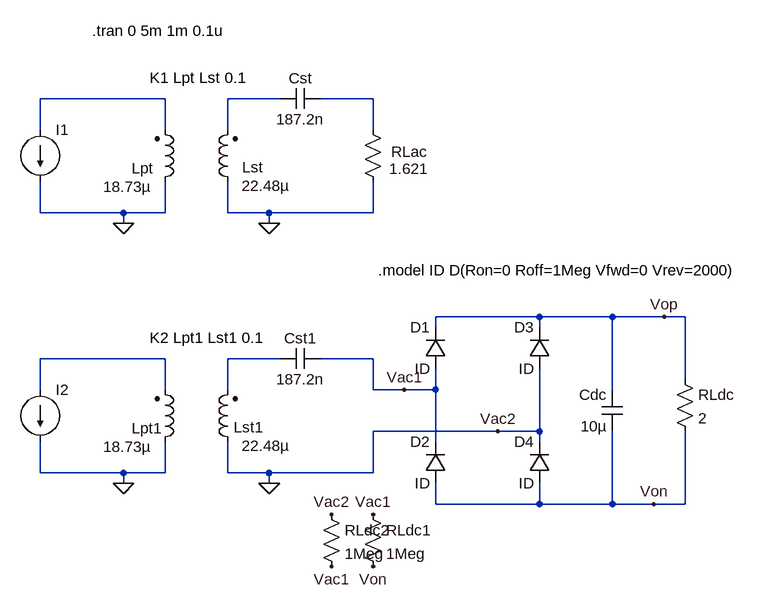
[diagram p0: schematic SSComp copy.asc]
SSComp copy.asc, the LTspice schematic file:
Version 4
SHEET 1 1144 1064
WIRE 256 240 64 240
WIRE 432 240 352 240
WIRE 576 240 496 240
WIRE 64 288 64 240
WIRE 256 288 256 240
WIRE 352 288 352 240
WIRE 576 288 576 240
WIRE 64 416 64 368
WIRE 192 416 64 416
WIRE 256 416 256 368
WIRE 256 416 192 416
WIRE 352 416 352 368
WIRE 416 416 352 416
WIRE 576 416 576 368
WIRE 576 416 416 416
WIRE 192 432 192 416
WIRE 416 432 416 416
WIRE 832 576 672 576
WIRE 944 576 832 576
WIRE 1024 576 944 576
WIRE 1056 576 1024 576
WIRE 672 592 672 576
WIRE 832 592 832 576
WIRE 256 640 64 640
WIRE 432 640 352 640
WIRE 576 640 496 640
WIRE 1056 672 1056 576
WIRE 64 688 64 640
WIRE 256 688 256 640
WIRE 352 688 352 640
WIRE 576 688 576 640
WIRE 624 688 576 688
WIRE 672 688 672 656
WIRE 672 688 624 688
WIRE 944 688 944 576
WIRE 768 752 576 752
WIRE 832 752 832 656
WIRE 832 752 768 752
WIRE 672 768 672 688
WIRE 832 768 832 752
WIRE 64 816 64 768
WIRE 192 816 64 816
WIRE 256 816 256 768
WIRE 256 816 192 816
WIRE 352 816 352 768
WIRE 416 816 352 816
WIRE 576 816 576 752
WIRE 576 816 416 816
WIRE 192 832 192 816
WIRE 416 832 416 816
WIRE 672 864 672 832
WIRE 832 864 832 832
WIRE 832 864 672 864
WIRE 944 864 944 752
WIRE 944 864 832 864
WIRE 1008 864 944 864
WIRE 1056 864 1056 752
WIRE 1056 864 1008 864
FLAG 192 432 0
FLAG 416 432 0
FLAG 192 832 0
FLAG 416 832 0
FLAG 1024 576 Vop
FLAG 1008 864 Von
FLAG 512 880 Vac2
FLAG 512 960 Vac1
FLAG 576 880 Vac1
FLAG 576 960 Von
FLAG 624 688 Vac1
FLAG 768 752 Vac2
SYMBOL ind2 240 384 M180
WINDOW 0 -35 37 Left 2
WINDOW 3 -79 8 Left 2
SYMATTR InstName Lpt
SYMATTR Value 18.73µ
SYMATTR Type ind
SYMBOL ind2 368 384 R180
WINDOW 0 -39 38 Left 2
WINDOW 3 -80 10 Left 2
SYMATTR InstName Lst
SYMATTR Value 22.48µ
SYMATTR Type ind
SYMATTR SpiceLine Rser=10m
SYMBOL current 64 288 R0
WINDOW 3 24 80 Invisible 2
SYMATTR Value SINE(0 14.14 85k 0 0 0)
SYMATTR InstName I1
SYMBOL res 560 272 R0
WINDOW 0 44 50 Left 2
WINDOW 3 41 76 Left 2
SYMATTR InstName RLac
SYMATTR Value 1.621
SYMBOL cap 496 224 R90
WINDOW 0 0 32 VBottom 2
WINDOW 3 32 32 VTop 2
SYMATTR InstName Cst
SYMATTR Value 187.2n
SYMBOL ind2 240 784 M180
WINDOW 0 -35 37 Left 2
WINDOW 3 -79 8 Left 2
SYMATTR InstName Lpt1
SYMATTR Value 18.73µ
SYMATTR Type ind
SYMBOL ind2 368 784 R180
WINDOW 0 -39 38 Left 2
WINDOW 3 -80 10 Left 2
SYMATTR InstName Lst1
SYMATTR Value 22.48µ
SYMATTR Type ind
SYMATTR SpiceLine Rser=10m
SYMBOL current 64 688 R0
WINDOW 3 24 80 Invisible 2
SYMATTR Value SINE(0 14.14 85k 0 0 0)
SYMATTR InstName I2
SYMBOL cap 496 624 R90
WINDOW 0 0 32 VBottom 2
WINDOW 3 32 32 VTop 2
SYMATTR InstName Cst1
SYMATTR Value 187.2n
SYMBOL diode 688 656 R180
WINDOW 0 24 64 Left 2
WINDOW 3 24 0 Left 2
SYMATTR InstName D1
SYMATTR Value ID
SYMBOL diode 688 832 R180
WINDOW 0 24 64 Left 2
WINDOW 3 24 0 Left 2
SYMATTR InstName D2
SYMATTR Value ID
SYMBOL diode 848 656 R180
WINDOW 0 24 64 Left 2
WINDOW 3 24 0 Left 2
SYMATTR InstName D3
SYMATTR Value ID
SYMBOL diode 848 832 R180
WINDOW 0 24 64 Left 2
WINDOW 3 24 0 Left 2
SYMATTR InstName D4
SYMATTR Value ID
SYMBOL cap 960 752 R180
WINDOW 0 24 56 Left 2
WINDOW 3 24 8 Left 2
SYMATTR InstName Cdc
SYMATTR Value 10µ
SYMBOL res 1040 656 R0
SYMATTR InstName RLdc
SYMATTR Value 2
SYMBOL res 560 864 R0
SYMATTR InstName RLdc1
SYMATTR Value 1Meg
SYMBOL res 496 864 R0
SYMATTR InstName RLdc2
SYMATTR Value 1Meg
TEXT 232 208 Left 2 !K1 Lpt Lst 0.1
TEXT 144 136 Left 2 !.tran 0 5m 1m 0.1u
TEXT 232 608 Left 2 !K2 Lpt1 Lst1 0.1
TEXT 584 504 Left 2 !.model ID D(Ron=0 Roff=1Meg Vfwd=0 Vrev=2000)

The netlist it stands for:
* SSComp copy.asc
Lpt 0 N001 18.73µ
Lst 0 N002 22.48µ Rser=10m
I1 N001 0 SINE(0 14.14 85k 0 0 0)
RLac N003 0 1.621
Cst N003 N002 187.2n
Lpt1 0 N004 18.73µ
Lst1 0 N005 22.48µ Rser=10m
I2 N004 0 SINE(0 14.14 85k 0 0 0)
Cst1 Vac1 N005 187.2n
D1 Vac1 Vop ID
D2 Von Vac1 ID
D3 0 Vop ID
D4 Von 0 ID
Cdc Von Vop 10µ
RLdc Vop Von 2
RLdc1 Vac1 Von 1Meg
RLdc2 0 Vac1 1Meg
.model D D
.lib standard.dio
K1 Lpt Lst 0.1
.tran 0 5m 1m 0.1u
K2 Lpt1 Lst1 0.1
.model ID D(Ron=0 Roff=1Meg Vfwd=0 Vrev=2000)
.backanno
.end